# Altium project APB.PrjPCB
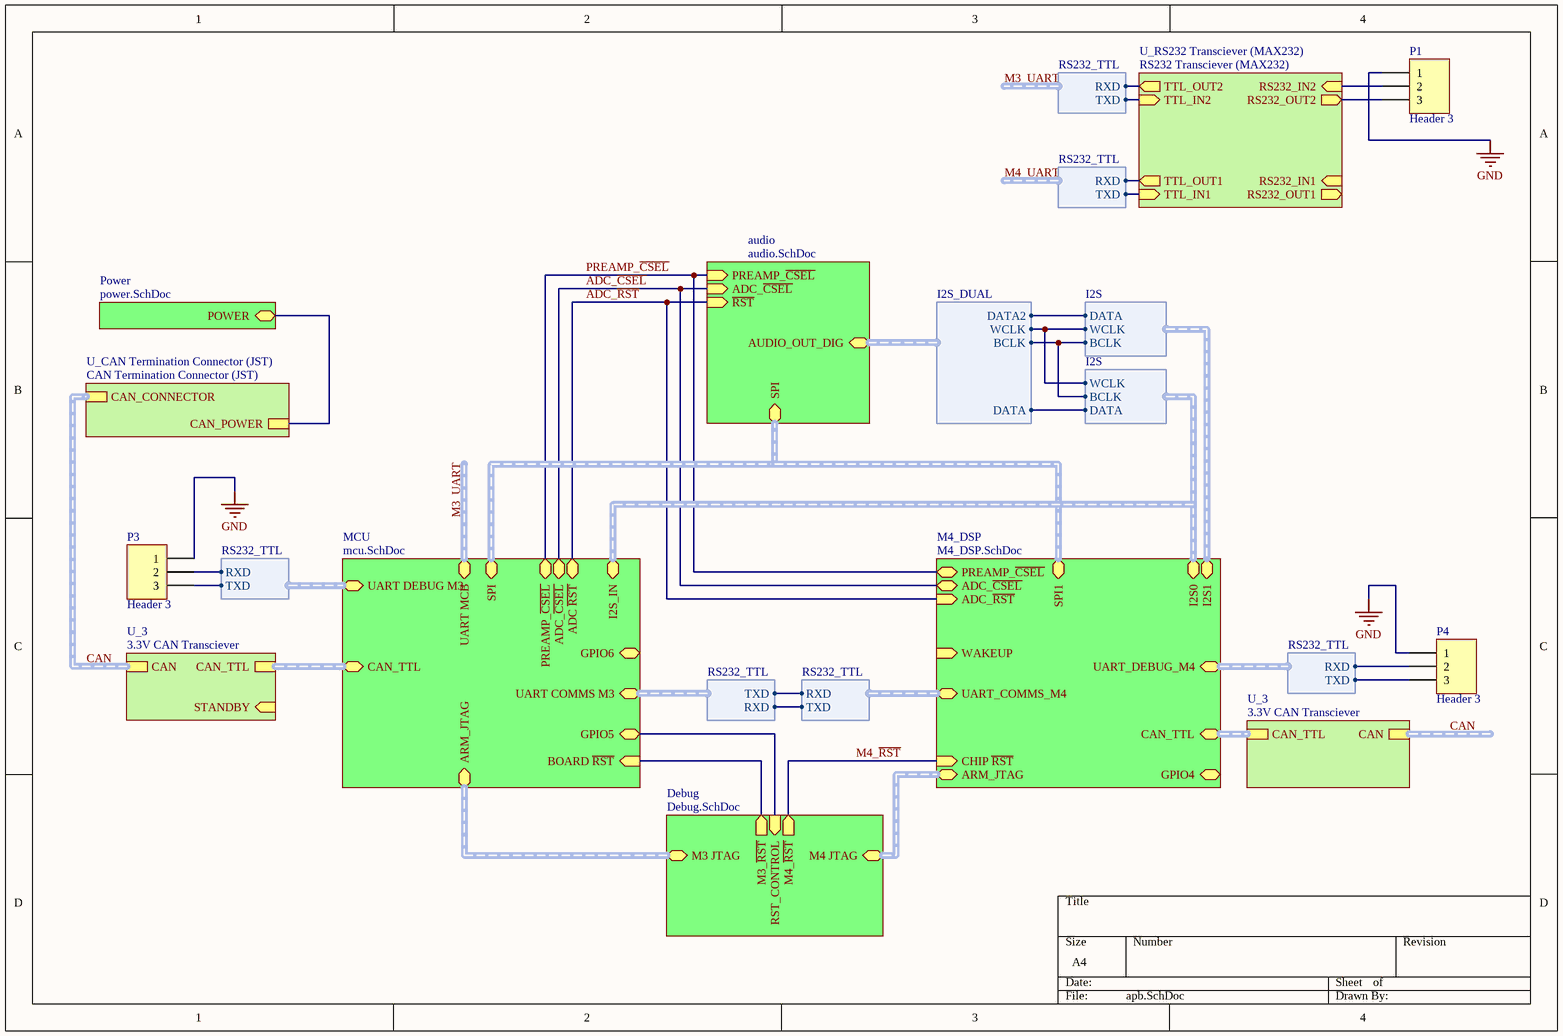
[diagram p0: apb.SchDoc]
7 sheets, 98 parts. Net scope: hierarchical (ports join the sheet entries above them; power ports are global).
Board file: APB.PcbDoc
Sheets:
  apb.SchDoc
    audio = audio.SchDoc
      Preamp = preamp.SchDoc
      Preamp = preamp.SchDoc
      Preamp = preamp.SchDoc
    Debug = Debug.SchDoc
    Power = power.SchDoc
  m4_debug.SchDoc
  SRAM.SchDoc

## Sheet apb.SchDoc
size A4

### Parts
P1  Header 3  [S03B-PASK-2]
P3  Header 3  [HDR1X3]
P4  Header 3  [HDR1X3]

### Sub-sheets
audio = audio.SchDoc: AUDIO_OUT_DIG (harness I2S_DUAL), SPI (harness SPI_NOCSEL), PREAMP_~{CSEL} (in), ADC_~{CSEL} (in), ~{RST} (in)
Debug = Debug.SchDoc: M3 JTAG (harness ARM_JTAG), M4 JTAG (harness ARM_JTAG), M4_~{RST} (out), M3_~{RST} (out), RST_CONTROL (in)
M4_DSP = M4_DSP.SchDoc (file not in this document): UART_DEBUG_M4 (harness RS232_TTL), UART_COMMS_M4 (harness RS232_TTL), I2S0 (harness I2S), CAN_TTL (harness CAN_TTL), SPI1 (harness SPI_NOCSEL), I2S1 (harness I2S), PREAMP_~{CSEL} (bidir), ADC_~{CSEL} (bidir), GPIO4 (bidir), ARM_JTAG (harness ARM_JTAG), CHIP ~{RST} (in), ADC_~{RST} (in), WAKEUP (in)
MCU = mcu.SchDoc (file not in this document): CAN_TTL (harness CAN_TTL), I2S_IN (harness I2S), UART COMMS M3 (harness RS232_TTL), UART MCB (harness RS232_TTL), UART DEBUG M3 (harness RS232_TTL), SPI (harness SPI_NOCSEL), ARM_JTAG (harness ARM_JTAG), PREAMP_~{CSEL} (bidir), ADC_~{CSEL} (bidir), ADC ~{RST} (bidir), BOARD ~{RST} (in), GPIO5 (bidir), GPIO6 (bidir)
Power = power.SchDoc: POWER
U_3 = 3.3V CAN Transciever (file not in this document): CAN_TTL (harness CAN_TTL), CAN (harness CAN)
U_3 = 3.3V CAN Transciever (file not in this document): CAN_TTL (harness CAN_TTL), CAN (harness CAN), STANDBY (in)
U_CAN Termination Connector (JST) = CAN Termination Connector (JST) (file not in this document): CAN_CONNECTOR (harness CAN), CAN_POWER
U_RS232 Transciever (MAX232) = RS232 Transciever (MAX232) (file not in this document): TTL_IN1 (in), RS232_OUT1 (out), TTL_IN2 (in), RS232_OUT2 (out), RS232_IN1 (in), RS232_IN2 (in), TTL_OUT1 (out), TTL_OUT2 (out)

### Harnesses
RS232_TTL: RXD, TXD
I2S_DUAL: BCLK, DATA, DATA2, WCLK
I2S: BCLK, DATA, WCLK

### Nets
GND: P1.1 P3.1 P4.1
ADC_~{CSEL}: sheet MCU/ADC_~{CSEL}, sheet M4_DSP/ADC_~{CSEL}, sheet audio/ADC_~{CSEL}
ADC_~{RST}: sheet MCU/ADC ~{RST}, sheet M4_DSP/ADC_~{RST}, sheet audio/~{RST}
M3_~{RST}: sheet MCU/BOARD ~{RST}, sheet Debug/M3_~{RST}
M3_UART.RXD: sheet U_RS232 Transciever (MAX232)/TTL_OUT2, sheet MCU/UART MCB.RXD
M3_UART.TXD: sheet U_RS232 Transciever (MAX232)/TTL_IN2, sheet MCU/UART MCB.TXD
M4_~{RST}: sheet M4_DSP/CHIP ~{RST}, sheet Debug/M4_~{RST}
M4_UART.RXD: sheet U_RS232 Transciever (MAX232)/TTL_OUT1, harness RS232_TTL.RXD
M4_UART.TXD: sheet U_RS232 Transciever (MAX232)/TTL_IN1, harness RS232_TTL.TXD
OUT1: sheet audio/AUDIO_OUT_DIG.BCLK, sheet M4_DSP/I2S1.BCLK, sheet MCU/I2S_IN.BCLK
OUT2: sheet audio/AUDIO_OUT_DIG.DATA, sheet MCU/I2S_IN.DATA
OUT3: sheet audio/AUDIO_OUT_DIG.DATA2, sheet M4_DSP/I2S1.DATA
OUT4: sheet audio/AUDIO_OUT_DIG.WCLK, sheet M4_DSP/I2S1.WCLK, sheet MCU/I2S_IN.WCLK
PREAMP_~{CSEL}: sheet MCU/PREAMP_~{CSEL}, sheet M4_DSP/PREAMP_~{CSEL}, sheet audio/PREAMP_~{CSEL}  [project net IN3]
NetL1_1: sheet U_CAN Termination Connector (JST)/CAN_POWER, sheet Power/POWER
NetP1_2: P1.2 ; sheet U_RS232 Transciever (MAX232)/RS232_IN2
NetP1_3: P1.3 ; sheet U_RS232 Transciever (MAX232)/RS232_OUT2
NetP3_2: P3.2 ; sheet MCU/UART DEBUG M3.RXD
NetP3_3: P3.3 ; sheet MCU/UART DEBUG M3.TXD
NetP4_2: P4.2 ; sheet M4_DSP/UART_DEBUG_M4.RXD
NetP4_3: P4.3 ; sheet M4_DSP/UART_DEBUG_M4.TXD
NetR34_1: sheet MCU/GPIO5, sheet Debug/RST_CONTROL
(unnamed): sheet MCU/UART COMMS M3.RXD, sheet M4_DSP/UART_COMMS_M4.TXD
(unnamed): sheet MCU/UART COMMS M3.TXD, sheet M4_DSP/UART_COMMS_M4.RXD

### Buses and harness runs
harness CAN = sheet U_3/CAN
harness CAN = sheet U_3/CAN = sheet U_CAN Termination Connector (JST)/CAN_CONNECTOR
harness M3_UART = sheet MCU/UART MCB
harness sheet audio/SPI = sheet M4_DSP/SPI1 = sheet MCU/SPI
harness sheet Debug/M3 JTAG = sheet MCU/ARM_JTAG
harness sheet Debug/M4 JTAG = sheet M4_DSP/ARM_JTAG
harness sheet M4_DSP/CAN_TTL = sheet U_3/CAN_TTL
harness sheet M4_DSP/I2S0 = sheet MCU/I2S_IN
harness sheet MCU/CAN_TTL = sheet U_3/CAN_TTL

### Library data of the parts
P1 P3 P4 = Header 3: Header, 3-Pin; LatestRevisionDate: 17-Jul-2002; LatestRevisionNote: Re-released for DXP Platform.; Publisher: Altium Limited

## Sheet audio.SchDoc
size A4
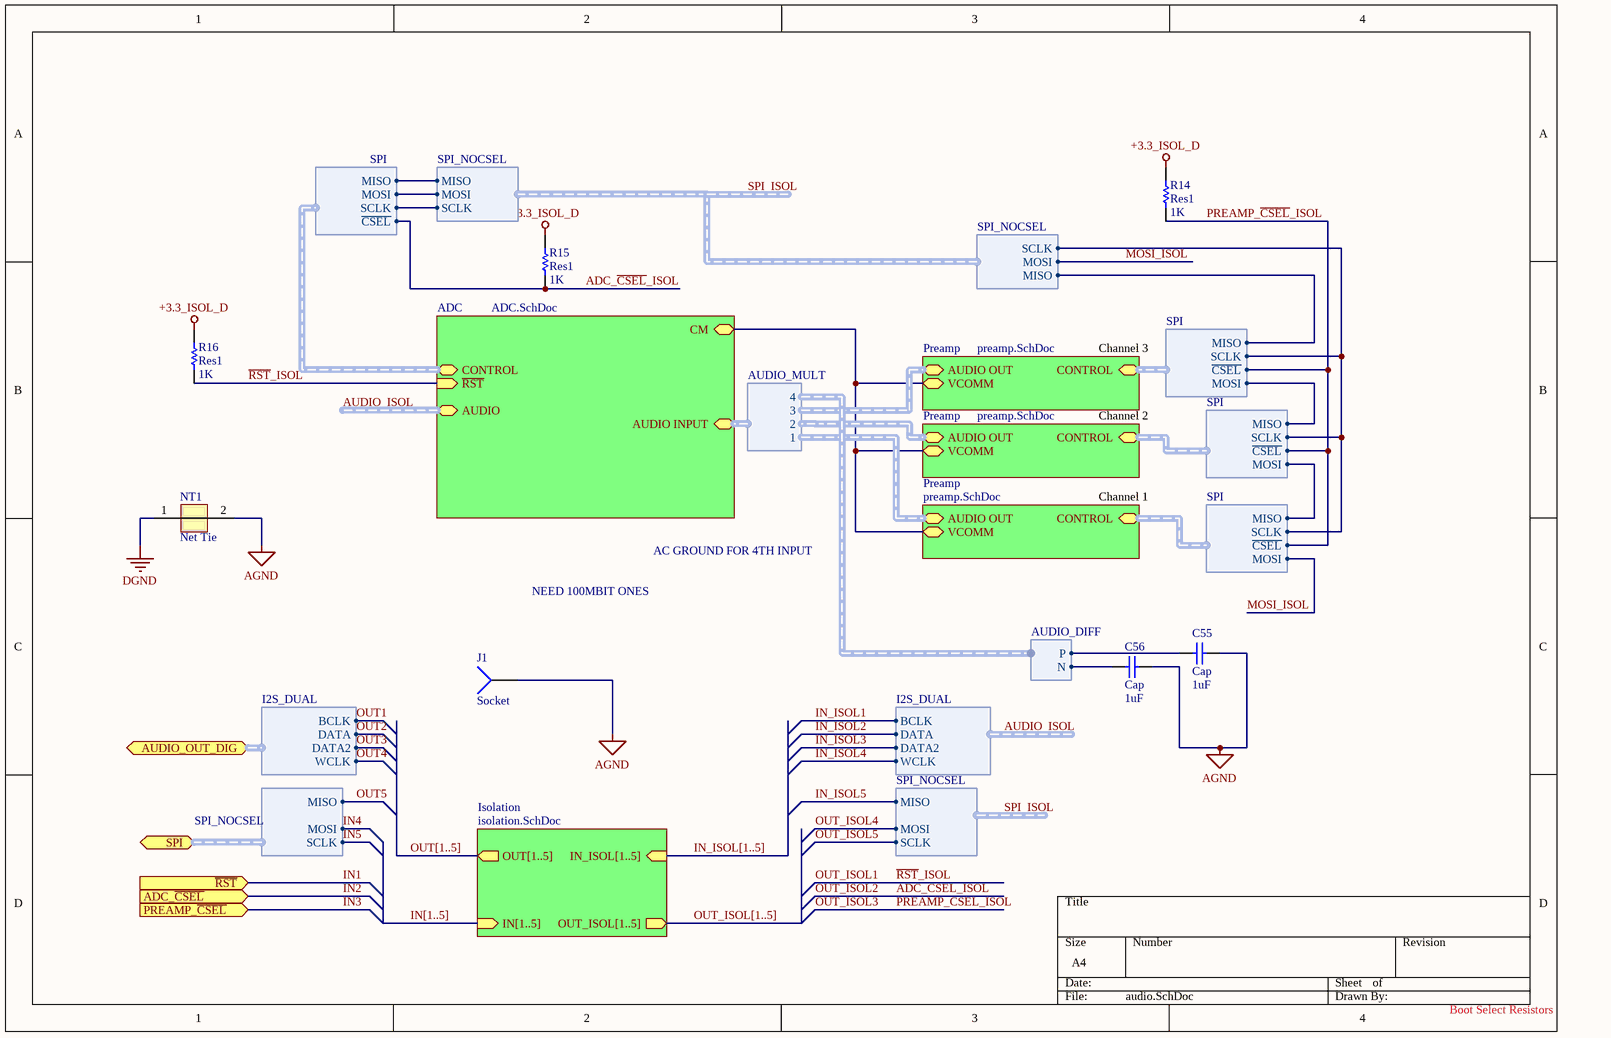
[diagram p1: audio.SchDoc]

### Parts
C55  Cap  value 1uF  [C0603]
C56  Cap  value 1uF  [C0603]
J1  Socket  [PIN1]
NT1  Net Tie  [NetTie]  (net tie, no BOM)
R14  Res1  value 1K  [R0603]
R15  Res1  value 1K  [R0603]
R16  Res1  value 1K  [R0603]

### Sub-sheets
ADC = ADC.SchDoc (file not in this document): CONTROL (harness SPI), ~{RST} (in), AUDIO (harness I2S_DUAL), AUDIO INPUT (harness AUDIO_MULT), CM
Isolation = isolation.SchDoc (file not in this document): OUT_ISOL[1..5] (out), OUT[1..5] (out), IN[1..5] (in), IN_ISOL[1..5] (in)
Preamp = preamp.SchDoc: CONTROL (harness SPI), AUDIO OUT (harness AUDIO_DIFF), VCOMM
Preamp = preamp.SchDoc: CONTROL (harness SPI), AUDIO OUT (harness AUDIO_DIFF), VCOMM
Preamp = preamp.SchDoc: CONTROL (harness SPI), AUDIO OUT (harness AUDIO_DIFF), VCOMM

### Ports
ADC_~{CSEL} (in), AUDIO_OUT_DIG (harness I2S_DUAL), PREAMP_~{CSEL} (in), SPI (harness SPI_NOCSEL), ~{RST} (in)

### Harnesses
AUDIO_MULT: 1, 2, 3, 4
SPI: ~{CSEL}, MISO, MOSI, SCLK
SPI_NOCSEL: MISO, MOSI, SCLK
I2S_DUAL: BCLK, DATA, DATA2, WCLK
AUDIO_DIFF: N, P

### Nets
+3.3_ISOL_D: R14.2 R15.2 R16.2
AGND: C55.1 C56.1 J1.1 NT1.2
DGND: NT1.1
ADC_~{CSEL}_ISOL: R15.1 ; sheet ADC/CONTROL.~{CSEL}  [also labelled OUT_ISOL2]
IN1: port ~{RST}  [project net ADC_~{RST}]
IN2: port ADC_~{CSEL}  [project net ADC_~{CSEL}]
IN3: port PREAMP_~{CSEL}
IN4: port SPI.MOSI
IN5: port SPI.SCLK
IN_ISOL1: sheet ADC/AUDIO.BCLK  [project net AUDIO_ISOL.BCLK]
IN_ISOL2: sheet ADC/AUDIO.DATA  [project net AUDIO_ISOL.DATA]
IN_ISOL3: sheet ADC/AUDIO.DATA2  [project net AUDIO_ISOL.DATA2]
IN_ISOL4: sheet ADC/AUDIO.WCLK  [project net AUDIO_ISOL.WCLK]
IN_ISOL5: sheet Preamp/CONTROL.MISO, sheet ADC/CONTROL.MISO, harness SPI_NOCSEL.MISO
MOSI_ISOL: sheet Preamp/CONTROL.MOSI, sheet ADC/CONTROL.MOSI, harness SPI_NOCSEL.MOSI  [also labelled OUT_ISOL4]
OUT1: port AUDIO_OUT_DIG.BCLK
OUT2: port AUDIO_OUT_DIG.DATA
OUT3: port AUDIO_OUT_DIG.DATA2
OUT4: port AUDIO_OUT_DIG.WCLK
OUT5: port SPI.MISO
OUT_ISOL1: R16.1 ; sheet ADC/~{RST}  [also labelled ~{RST}_ISOL]
OUT_ISOL3: R14.1 ; sheet Preamp/CONTROL.~{CSEL}  [also labelled PREAMP_~{CSEL}_ISOL]
OUT_ISOL5: sheet Preamp/CONTROL.SCLK, sheet ADC/CONTROL.SCLK, harness SPI_NOCSEL.SCLK
NetC55_2: C55.2 ; harness AUDIO_DIFF.P
NetC56_2: C56.2 ; harness AUDIO_DIFF.N
NetC63_audio_Preamp#1_2: sheet Preamp/VCOMM, sheet ADC/CM, sheet Preamp/VCOMM, sheet Preamp/VCOMM
NetU9_audio_Preamp#1_8: sheet Preamp/CONTROL.MOSI, sheet Preamp/CONTROL.MISO
NetU9_audio_Preamp#2_8: sheet Preamp/CONTROL.MOSI, sheet Preamp/CONTROL.MISO

### Buses and harness runs
bus IN[1..5] = sheet Isolation/IN[1..5]
bus IN_ISOL[1..5] = sheet Isolation/IN_ISOL[1..5]
bus OUT[1..5] = sheet Isolation/OUT[1..5]
bus OUT_ISOL[1..5] = sheet Isolation/OUT_ISOL[1..5]
harness AUDIO_ISOL = sheet ADC/AUDIO

### Notes on the sheet
- Channel 3
- Channel 2
- Channel 1
- AC GROUND FOR 4TH INPUT
- NEED 100MBIT ONES
- Boot Select Resistors

### Library data of the parts
C55 C56 = Cap: Capacitor; Published: 8-Jun-2000; LatestRevisionDate: 17-Jul-2002; LatestRevisionNote: Re-released for DXP Platform.; PackageReference: RAD-0.3; Publisher: Altium Limited
NT1 = NetTie
R14-R16 = Res1: Resistor; Published: 8-Jun-2000; LatestRevisionDate: 17-Jul-2002; LatestRevisionNote: Re-released for DXP Platform.; PackageReference: AXIAL-0.3; Publisher: Altium Limited
J1 = Socket: LatestRevisionDate: 17-Jul-2002; LatestRevisionNote: Re-released for DXP Platform.; Publisher: Altium Limited

## Sheet preamp.SchDoc
size A4
Used 3 times, as channels audio/Preamp, audio/Preamp, audio/Preamp. Parts and nets are listed once, with the designators drawn on the sheet.
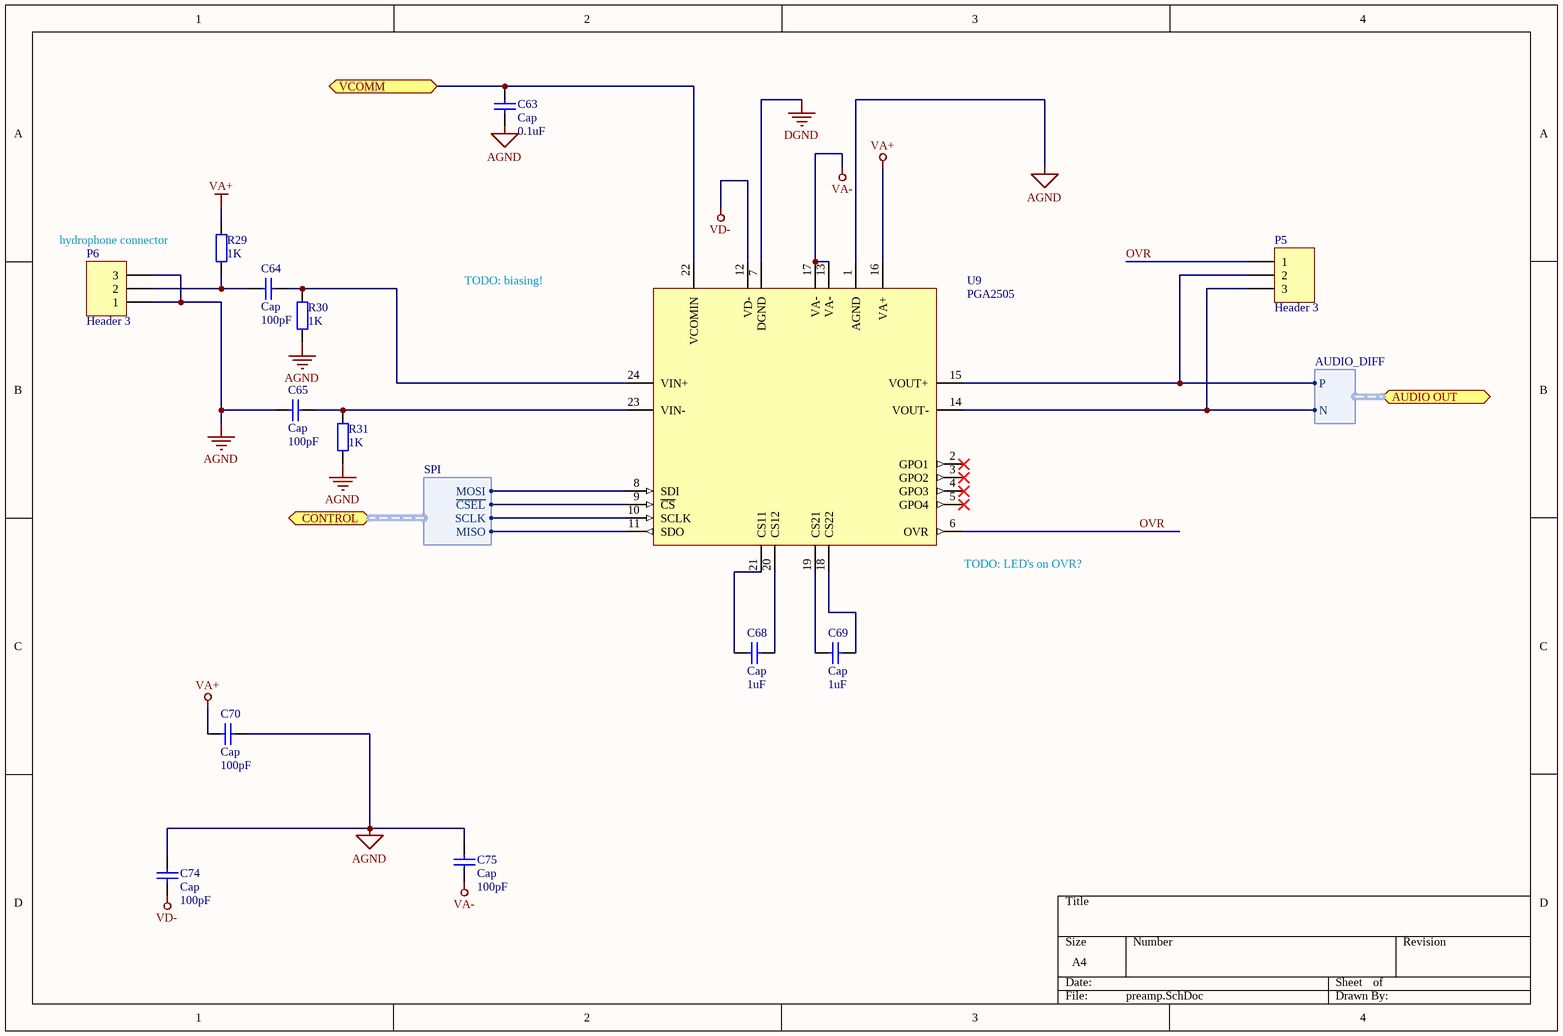
[diagram p2: preamp.SchDoc]

### Parts
C63  Cap  value 0.1uF  [C0603]
C64  Cap  value 100pF  [C0603]
C65  Cap  value 100pF  [C0603]
C68  Cap  value 1uF  [C0603]
C69  Cap  value 1uF  [C0603]
C70  Cap  value 100pF  [C0603]
C74  Cap  value 100pF  [C0603]
C75  Cap  value 100pF  [C0603]
P5  Header 3  [HDR1X3]
P6  Header 3  [S03B-PASK-2]
R29  value 1K  [R0603]  (hidden comment: Res2)
R30  value 1K  [R0603]  (hidden comment: Res2)
R31  value 1K  [R0603]  (hidden comment: Res2)
U9  PGA2505  [SOP65P780X200-24N]

### Ports
AUDIO OUT (harness AUDIO_DIFF), CONTROL (harness SPI), VCOMM

### Harnesses
SPI: ~{CSEL}, MISO, MOSI, SCLK
AUDIO_DIFF: N, P

### Nets
AGND: C63.1 C65.2 C70.2 C74.2 C75.2 P6.1 P6.3 R30.1 R31.1 U9.1(AGND)
DGND: U9.7(DGND)
VA+: C70.1 R29.2 U9.16(VA+)
VA-: C75.1 U9.13(VA-) U9.17(VA-)
VD-: C74.1 U9.12(VD-)
OVR: P5.1 U9.6(OVR)
VCOMM: C63.2 U9.22(VCOMIN) ; port VCOMM
NetC64_1: C64.1 R30.2 U9.24(VIN+)
NetC64_2: C64.2 P6.2 R29.1
NetC65_1: C65.1 R31.2 U9.23(VIN-)
NetC68_1: C68.1 U9.21(CS11)
NetC68_2: C68.2 U9.20(CS12)
NetC69_1: C69.1 U9.19(CS21)
NetC69_2: C69.2 U9.18(CS22)
NetP5_2: P5.2 U9.15(VOUT+) ; port AUDIO OUT.P
NetP5_3: P5.3 U9.14(VOUT-) ; port AUDIO OUT.N
NetU9_8: U9.8(SDI) ; port CONTROL.MOSI
NetU9_9: U9.9(~{CS}) ; port CONTROL.~{CSEL}
NetU9_10: U9.10(SCLK) ; port CONTROL.SCLK
NetU9_11: U9.11(SDO) ; port CONTROL.MISO

Not connected (* = marked no-connect by the designer): U9 2(GPO1)* 3(GPO2)* 4(GPO3)* 5(GPO4)*

### Channels
audio/Preamp: designators end in _audio_Preamp#1; ports VCOMM=NetC63_audio_Preamp#1_2
audio/Preamp: designators end in _audio_Preamp#2; ports VCOMM=NetC63_audio_Preamp#1_2
audio/Preamp: designators end in _audio_Preamp#3; ports VCOMM=NetC63_audio_Preamp#1_2

### Notes on the sheet
- hydrophone connector
- TODO: biasing!
- (near U9) TODO: LED's on OVR?

### Library data of the parts
C63-C65 C68-C70 C74 C75 = Cap: Capacitor; Published: 8-Jun-2000; LatestRevisionDate: 17-Jul-2002; LatestRevisionNote: Re-released for DXP Platform.; PackageReference: RAD-0.3; Publisher: Altium Limited
P5 P6 = Header 3: Header, 3-Pin; LatestRevisionDate: 17-Jul-2002; LatestRevisionNote: Re-released for DXP Platform.; Publisher: Altium Limited
R29-R31 = Res2: Resistor; Published: 8-Jun-2000; LatestRevisionDate: 17-Jul-2002; LatestRevisionNote: Re-released for DXP Platform.; PackageReference: AXIAL-0.4; Publisher: Altium Limited
U9 = PGA2505: IC, MICROPHONE AMP, 24TSSOP; farnell: 1735567

## Sheet Debug.SchDoc
size A4
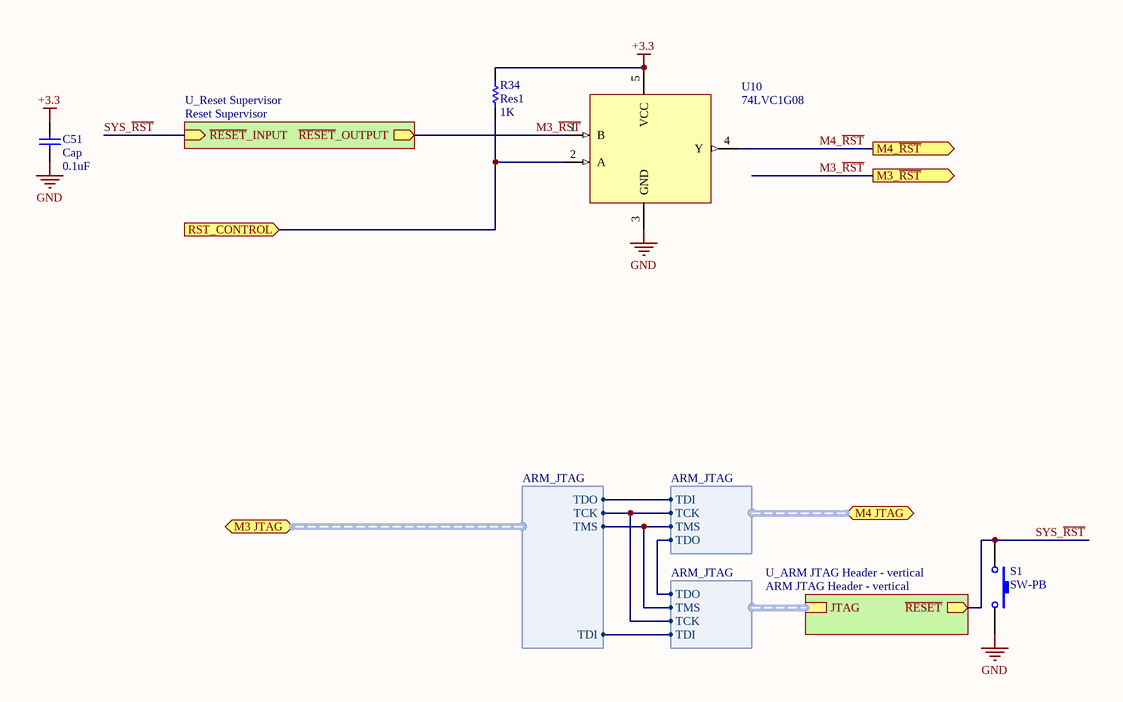
[diagram p3: Debug.SchDoc]

### Parts
C51  Cap  value 0.1uF  [C0603]
R34  Res1  value 1K  [R0603]
S1  SW-PB  [DTSM-32S-B]
U10  74LVC1G08  [SOT23127P600-8N]

### Sub-sheets
U_ARM JTAG Header - vertical = ARM JTAG Header - vertical (file not in this document): JTAG (harness ARM_JTAG), ~{RESET} (out)
U_Reset Supervisor = Reset Supervisor (file not in this document): ~{RESET}_OUTPUT (out), ~{RESET}_INPUT (in)

### Ports
M3 JTAG (harness ARM_JTAG), M3_~{RST} (out), M4 JTAG (harness ARM_JTAG), M4_~{RST} (out), RST_CONTROL (in)

### Harnesses
ARM_JTAG: TCK, TDI, TDO, TMS

### Nets
+3.3: C51.1 R34.2 U10.5(VCC)
GND: C51.2 S1.2 U10.3(GND)
M3_~{RST}: U10.1(B) ; port M3_~{RST}, sheet U_Reset Supervisor/~{RESET}_OUTPUT
M4_~{RST}: U10.4(Y) ; port M4_~{RST}
SYS_~{RST}: S1.1 ; sheet U_Reset Supervisor/~{RESET}_INPUT, sheet U_ARM JTAG Header - vertical/~{RESET}
NetR34_1: R34.1 U10.2(A) ; port RST_CONTROL
(unnamed): port M3 JTAG.TCK, port M4 JTAG.TCK, sheet U_ARM JTAG Header - vertical/JTAG.TCK
(unnamed): port M3 JTAG.TDI, sheet U_ARM JTAG Header - vertical/JTAG.TDI
(unnamed): port M3 JTAG.TDO, port M4 JTAG.TDI
(unnamed): port M3 JTAG.TMS, port M4 JTAG.TMS, sheet U_ARM JTAG Header - vertical/JTAG.TMS
(unnamed): port M4 JTAG.TDO, sheet U_ARM JTAG Header - vertical/JTAG.TDO

### Library data of the parts
C51 = Cap: Capacitor; Published: 8-Jun-2000; LatestRevisionDate: 17-Jul-2002; LatestRevisionNote: Re-released for DXP Platform.; PackageReference: RAD-0.3; Publisher: Altium Limited
R34 = Res1: Resistor; Published: 8-Jun-2000; LatestRevisionDate: 17-Jul-2002; LatestRevisionNote: Re-released for DXP Platform.; PackageReference: AXIAL-0.3; Publisher: Altium Limited
S1 = SW-PB: Switch; Published: 24-Mar-1999; LatestRevisionDate: 17-Jul-2002; LatestRevisionNote: Re-released for DXP Platform.; PackageReference: SPST-2; Publisher: Altium Limited
U10 = 74LVC1G08: farnell: 1631684

## Sheet power.SchDoc
size A4
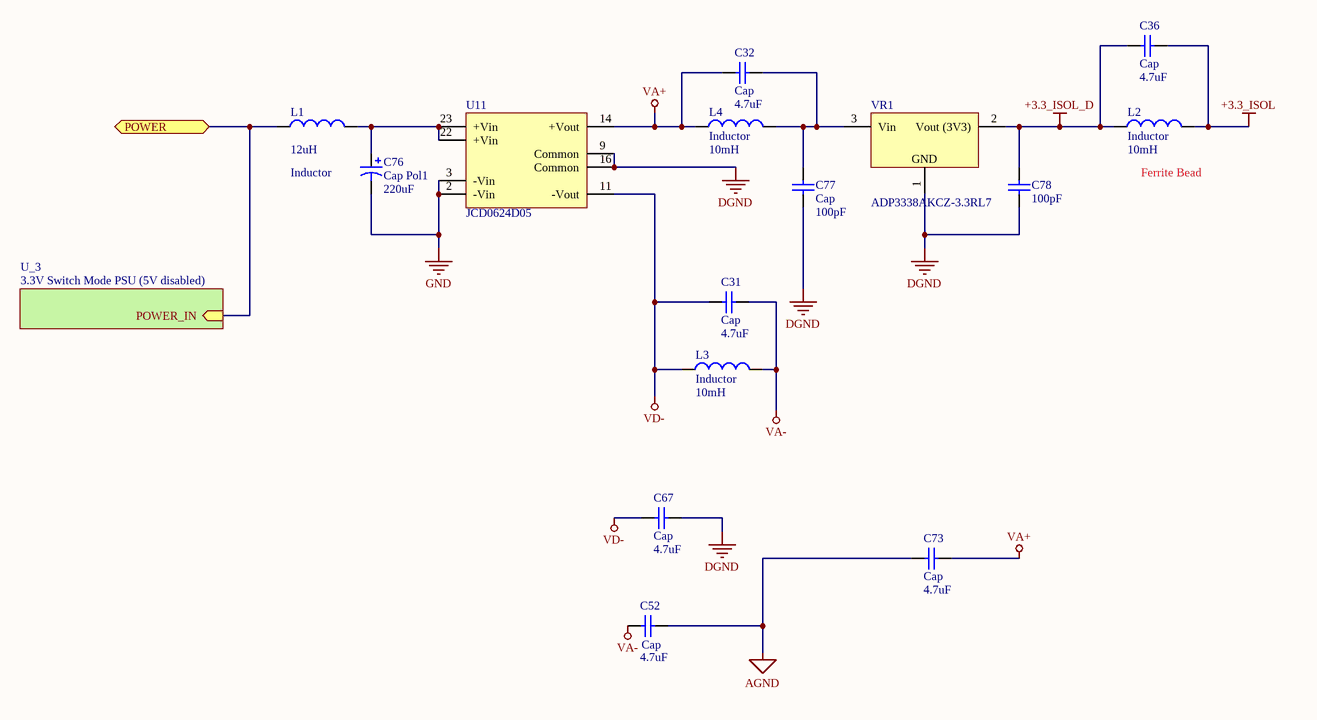
[diagram p4: power.SchDoc]

### Parts
C31  Cap  value 4.7uF  [C0603]
C32  Cap  value 4.7uF  [C0603]
C36  Cap  value 4.7uF  [C0603]
C52  Cap  value 4.7uF  [C0603]
C67  Cap  value 4.7uF  [C0603]
C73  Cap  value 4.7uF  [C0603]
C76  Cap Pol1  value 220uF  [Capacitor]
C77  Cap  value 100pF  [C0805]
C78  value 100pF  [C0805]  (hidden comment: Cap)
L1  Inductor  value 12uH  [SDR0604-150YL]
L2  Inductor  value 10mH  [C0805]
L3  Inductor  value 10mH  [C0805]
L4  Inductor  value 10mH  [C0805]
U11  JCD0624D05  [DIP24]
VR1  ADP3338AKCZ-3.3RL7  [ADP3338AKCZ-3.3RL7]

### Sub-sheets
U_3 = 3.3V Switch Mode PSU (5V disabled) (file not in this document): POWER_IN (in)

### Ports
POWER

### Nets
+3.3_ISOL: C36.2 L2.2
+3.3_ISOL_D: C36.1 C78.1 L2.1 VR1.2(Vout_(3V3))
AGND: C52.2 C73.1
DGND: C67.2 C77.1 C78.2 U11.9(Common) U11.16(Common) VR1.1(GND)
GND: C76.2 U11.2(-Vin) U11.3(-Vin)
VA+: C32.1 C73.2 L4.1 U11.14(+Vout)
VA-: C31.2 C52.1 L3.2
VD-: C31.1 C67.1 L3.1 U11.11(-Vout)
NetC32_2: C32.2 C77.2 L4.2 VR1.3(Vin)
NetC76_1: C76.1 L1.2 U11.22(+Vin) U11.23(+Vin)
NetL1_1: L1.1 ; port POWER, sheet U_3/POWER_IN

### Notes on the sheet
- (near L2) Ferrite Bead

### Library data of the parts
C31 C32 C36 C52 C67 C73 C77 C78 = Cap: Capacitor; Published: 8-Jun-2000; LatestRevisionDate: 17-Jul-2002; LatestRevisionNote: Re-released for DXP Platform.; PackageReference: RAD-0.3; Publisher: Altium Limited
C76 = Cap Pol1: Polarized Capacitor (Radial); Published: 8-Jun-2000; LatestRevisionDate: 17-Jul-2002; LatestRevisionNote: Re-released for DXP Platform.; PackageReference: RB7.6-15; Publisher: Altium Limited; farnell: 1831303
L1-L4 = Inductor: Code_IEC: 1005; Published: 8-Jun-2000; LatestRevisionDate: 29-May-2009; LatestRevisionNote: IPC-7351 Footprint Added.; PackageReference: 0402-A; Publisher: Altium Limited; PackageDescription: Chip Inductor; Code_JEITA: 0402
  L1: farnell: 744773112
U11 = JCD0624D05: DC/DC CONVERTER, 6W, +/-5V, DIP-24; farnell: 2065315
VR1 = ADP3338AKCZ-3.3RL7: 3.3V LDO Regulator; farnell: 1651283

## Sheet m4_debug.SchDoc
size A4
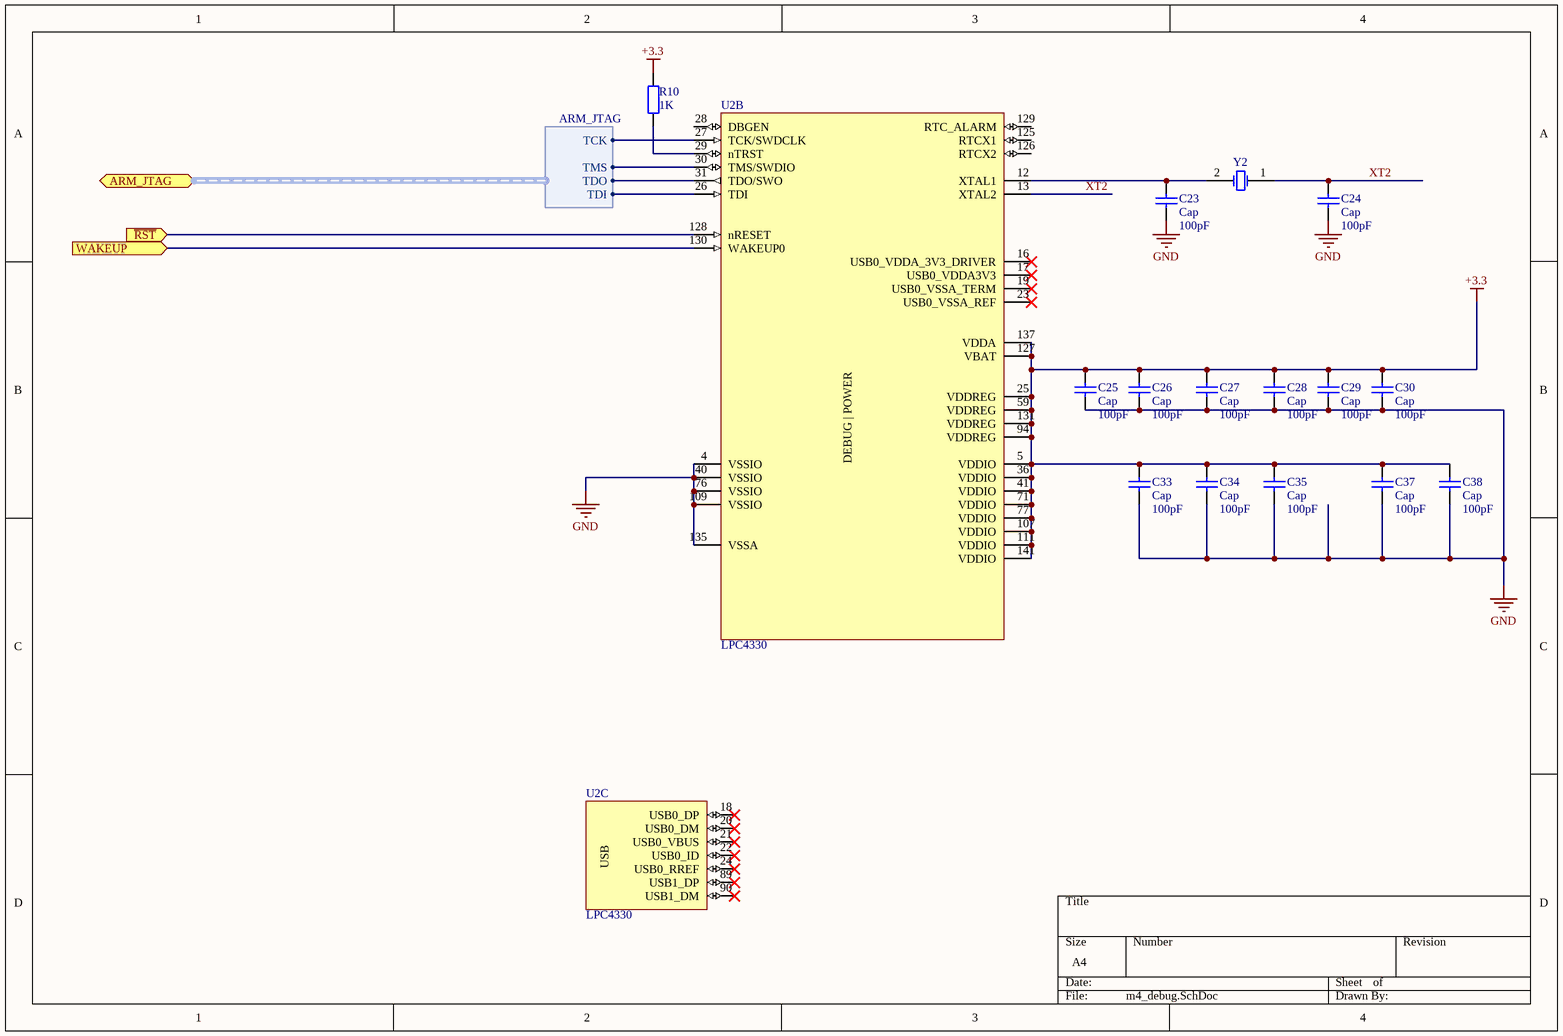
[diagram p5: m4_debug.SchDoc]

### Parts
C23  Cap  value 100pF  [C0603]
C24  Cap  value 100pF  [C0603]
C25  Cap  value 100pF  [C0603]
C26  Cap  value 100pF  [C0603]
C27  Cap  value 100pF  [C0603]
C28  Cap  value 100pF  [C0603]
C29  Cap  value 100pF  [C0603]
C30  Cap  value 100pF  [C0603]
C33  Cap  value 100pF  [C0603]
C34  Cap  value 100pF  [C0603]
C35  Cap  value 100pF  [C0603]
C37  Cap  value 100pF  [C0603]
C38  Cap  value 100pF  [C0603]
R10  value 1K  [R0603]  (hidden comment: Res2)
U2  LPC4330  [TSQFP50P2200X2200X160-144N]  (parts B,C of 5)
Y2  XTAL  [C3E-24.000-12-3030-X]  (value not drawn)

### Ports
ARM_JTAG (harness ARM_JTAG), WAKEUP (in), ~{RST} (in)

### Harnesses
ARM_JTAG: TCK, TDI, TDO, TMS

### Nets
+3.3: C25.1 C26.1 C27.1 C28.1 C29.1 C30.1 C33.1 C34.1 C35.1 C37.1 C38.1 R10.2 U2.5(VDDIO) U2.25(VDDREG) U2.36(VDDIO) U2.41(VDDIO) U2.59(VDDREG) U2.71(VDDIO) U2.77(VDDIO) U2.94(VDDREG) U2.107(VDDIO) U2.111(VDDIO) U2.127(VBAT) U2.131(VDDREG) U2.137(VDDA) U2.141(VDDIO)
GND: C23.1 C24.1 C25.2 C26.2 C27.2 C28.2 C29.2 C30.2 C33.2 C34.2 C35.2 C37.2 C38.2 U2.4(VSSIO) U2.40(VSSIO) U2.76(VSSIO) U2.109(VSSIO) U2.135(VSSA)
XT2: C24.2 U2.13(XTAL2) Y2.1(OSC1)
NetC23_2: C23.2 U2.12(XTAL1) Y2.2(OSC2)
NetR10_1: R10.1 U2.29(nTRST)
NetU2_26: U2.26(TDI) ; port ARM_JTAG.TDI
NetU2_27: U2.27(TCK/SWDCLK) ; port ARM_JTAG.TCK
NetU2_30: U2.30(TMS/SWDIO) ; port ARM_JTAG.TMS
NetU2_31: U2.31(TDO/SWO) ; port ARM_JTAG.TDO
NetU2_128: U2.128(nRESET) ; port ~{RST}
NetU2_130: U2.130(WAKEUP0) ; port WAKEUP

Not connected (* = marked no-connect by the designer): U2 16(USB0_VDDA_3V3_DRIVER)* 17(USB0_VDDA3V3)* 18(USB0_DP)* 19(USB0_VSSA_TERM)* 20(USB0_DM)* 21(USB0_VBUS)* 22(USB0_ID)* 23(USB0_VSSA_REF)* 24(USB0_RREF)* 28(DBGEN) 89(USB1_DP)* 90(USB1_DM)* 125(RTCX1) 126(RTCX2) 129(RTC_ALARM)

### Notes on the sheet
- (in symbol LPC4330, part B) DEBUG | POWER
- (in symbol LPC4330, part C) USB

### Library data of the parts
C23-C30 C33-C35 C37 C38 = Cap: Capacitor; Published: 8-Jun-2000; LatestRevisionDate: 17-Jul-2002; LatestRevisionNote: Re-released for DXP Platform.; PackageReference: RAD-0.3; Publisher: Altium Limited
R10 = Res2: Resistor; Published: 8-Jun-2000; LatestRevisionDate: 17-Jul-2002; LatestRevisionNote: Re-released for DXP Platform.; PackageReference: AXIAL-0.4; Publisher: Altium Limited
U2 = LPC4330: MCU, 32BIT, ARM CORTEX M4&M0, 144LQFP; farnell: 2094316
Y2 = XTAL: Crystal Oscillator; Published: 8-Jun-2000; LatestRevisionDate: 17-Jul-2002; LatestRevisionNote: Re-released for DXP Platform.; PackageReference: R38; Publisher: Altium Limited

## Sheet SRAM.SchDoc
size A4
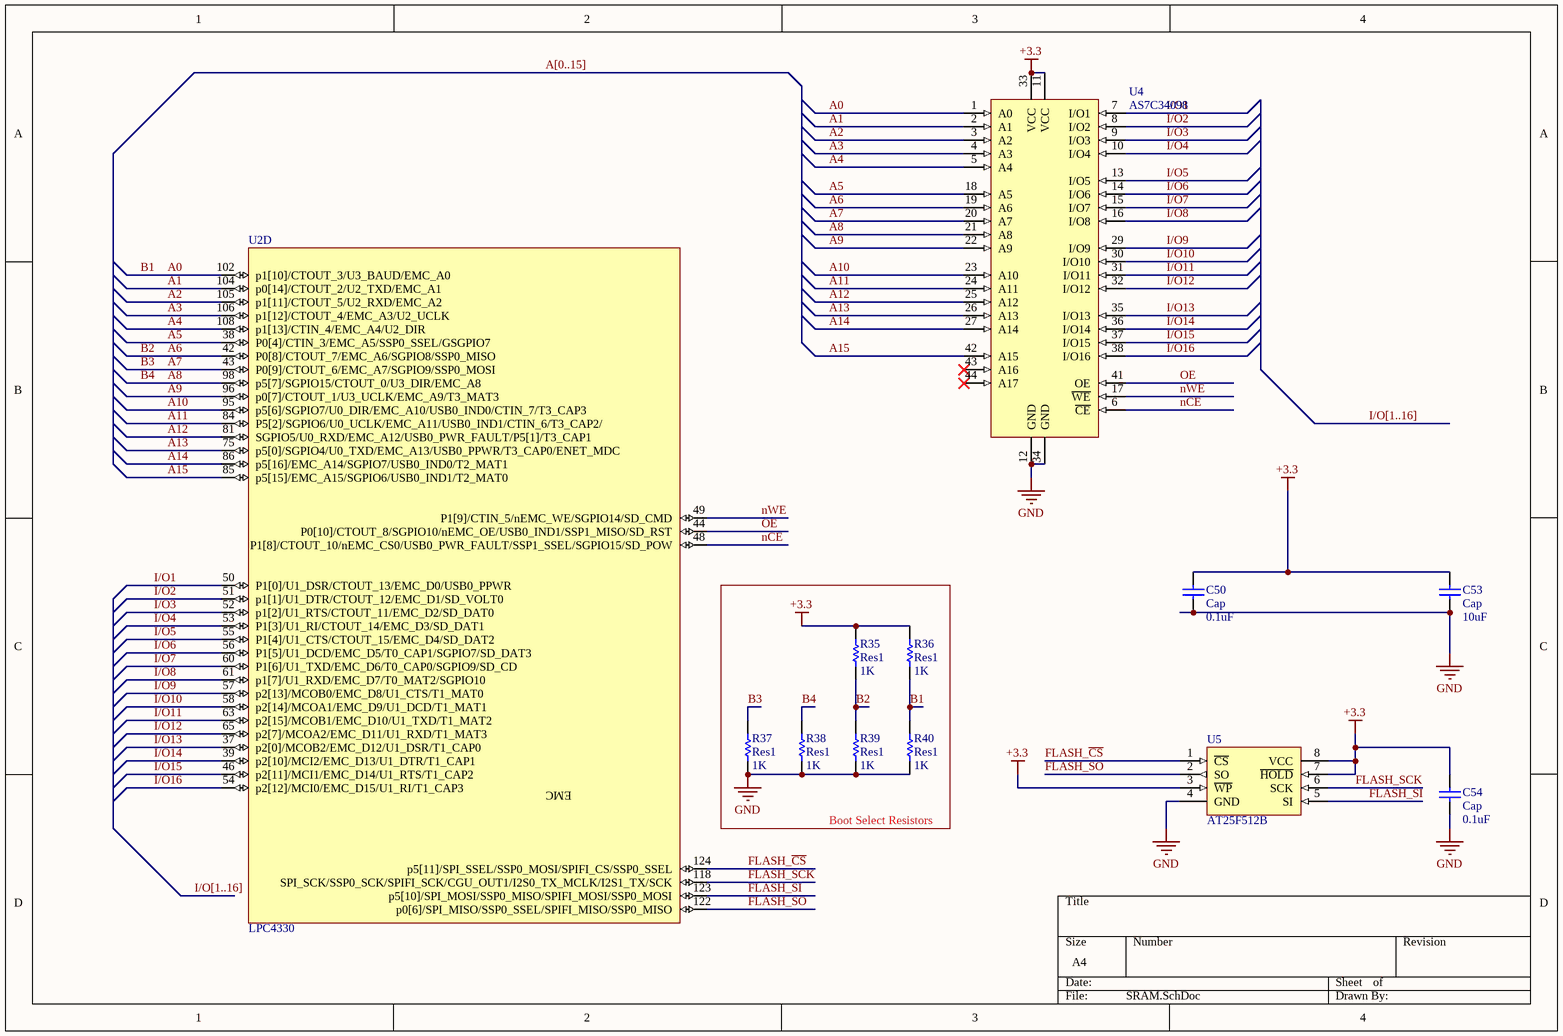
[diagram p6: SRAM.SchDoc]

### Parts
C50  Cap  value 0.1uF  [C0603]
C53  Cap  value 10uF  [C0603]
C54  Cap  value 0.1uF  [C0603]
R35  Res1  value 1K  [R0603]
R36  Res1  value 1K  [R0603]
R37  Res1  value 1K  [R0603]
R38  Res1  value 1K  [R0603]
R39  Res1  value 1K  [R0603]
R40  Res1  value 1K  [R0603]
U2  LPC4330  [TSQFP50P2200X2200X160-144N]  (part D of 5)
U4  AS7C34098  [TSOP80P1180X120-44N]
U5  AT25F512B  [SOIC127P600-8N]

### Blocks framed on the sheet
Boot Select Resistors: R35-R40

### Nets
+3.3: C50.2 C53.2 C54.2 R35.2 R36.2 U4.11(VCC) U4.33(VCC) U5.3(~{WP}) U5.7(~{HOLD}) U5.8(VCC)
GND: C50.1 C53.1 C54.1 R37.1 R38.1 R39.1 R40.1 U4.12(GND) U4.34(GND) U5.4(GND)
A0: R36.1 R40.2 U2.102(p1[10]/CTOUT_3/U3_BAUD/EMC_A0) U4.1(A0)  [also labelled B1]
A1: U2.104(p0[14]/CTOUT_2/U2_TXD/EMC_A1) U4.2(A1)
A2: U2.105(p1[11]/CTOUT_5/U2_RXD/EMC_A2) U4.3(A2)
A3: U2.106(p1[12]/CTOUT_4/EMC_A3/U2_UCLK) U4.4(A3)
A4: U2.108(p1[13]/CTIN_4/EMC_A4/U2_DIR) U4.5(A4)
A5: U2.38(P0[4]/CTIN_3/EMC_A5/SSP0_SSEL/GSGPIO7) U4.18(A5)
A6: R35.1 R39.2 U2.42(P0[8]/CTOUT_7/EMC_A6/SGPIO8/SSP0_MISO) U4.19(A6)  [also labelled B2]
A7: R37.2 U2.43(P0[9]/CTOUT_6/EMC_A7/SGPIO9/SSP0_MOSI) U4.20(A7)  [also labelled B3]
A8: R38.2 U2.98(p5[7]/SGPIO15/CTOUT_0/U3_DIR/EMC_A8) U4.21(A8)  [also labelled B4]
A9: U2.96(p0[7]/CTOUT_1/U3_UCLK/EMC_A9/T3_MAT3) U4.22(A9)
A10: U2.95(p5[6]/SGPIO7/U0_DIR/EMC_A10/USB0_IND0/CTIN_7/T3_CAP3) U4.23(A10)
A11: U2.84(P5[2]/SGPIO6/U0_UCLK/EMC_A11/USB0_IND1/CTIN_6/T3_CAP2/) U4.24(A11)
A12: U2.81(SGPIO5/U0_RXD/EMC_A12/USB0_PWR_FAULT/P5[1]/T3_CAP1) U4.25(A12)
A13: U2.75(p5[0]/SGPIO4/U0_TXD/EMC_A13/USB0_PPWR/T3_CAP0/ENET_MDC) U4.26(A13)
A14: U2.86(p5[16]/EMC_A14/SGPIO7/USB0_IND0/T2_MAT1) U4.27(A14)
A15: U2.85(p5[15]/EMC_A15/SGPIO6/USB0_IND1/T2_MAT0) U4.42(A15)
FLASH_~{CS}: U2.124(p5[11]/SPI_SSEL/SSP0_MOSI/SPIFI_CS/SSP0_SSEL) U5.1(~{CS})
FLASH_SCK: U2.118(SPI_SCK/SSP0_SCK/SPIFI_SCK/CGU_OUT1/I2S0_TX_MCLK/I2S1_TX/SCK) U5.6(SCK)
FLASH_SI: U2.123(p5[10]/SPI_MOSI/SSP0_MISO/SPIFI_MOSI/SSP0_MOSI) U5.5(SI)
FLASH_SO: U2.122(p0[6]/SPI_MISO/SSP0_SSEL/SPIFI_MISO/SSP0_MISO) U5.2(SO)
I/O1: U2.50(P1[0]/U1_DSR/CTOUT_13/EMC_D0/USB0_PPWR) U4.7(I/O1)
I/O2: U2.51(p1[1]/U1_DTR/CTOUT_12/EMC_D1/SD_VOLT0) U4.8(I/O2)
I/O3: U2.52(p1[2]/U1_RTS/CTOUT_11/EMC_D2/SD_DAT0) U4.9(I/O3)
I/O4: U2.53(P1[3]/U1_RI/CTOUT_14/EMC_D3/SD_DAT1) U4.10(I/O4)
I/O5: U2.55(P1[4]/U1_CTS/CTOUT_15/EMC_D4/SD_DAT2) U4.13(I/O5)
I/O6: U2.56(P1[5]/U1_DCD/EMC_D5/T0_CAP1/SGPIO7/SD_DAT3) U4.14(I/O6)
I/O7: U2.60(P1[6]/U1_TXD/EMC_D6/T0_CAP0/SGPIO9/SD_CD) U4.15(I/O7)
I/O8: U2.61(p1[7]/U1_RXD/EMC_D7/T0_MAT2/SGPIO10) U4.16(I/O8)
I/O9: U2.57(p2[13]/MCOB0/EMC_D8/U1_CTS/T1_MAT0) U4.29(I/O9)
I/O10: U2.58(p2[14]/MCOA1/EMC_D9/U1_DCD/T1_MAT1) U4.30(I/O10)
I/O11: U2.63(p2[15]/MCOB1/EMC_D10/U1_TXD/T1_MAT2) U4.31(I/O11)
I/O12: U2.65(p2[7]/MCOA2/EMC_D11/U1_RXD/T1_MAT3) U4.32(I/O12)
I/O13: U2.37(p2[0]/MCOB2/EMC_D12/U1_DSR/T1_CAP0) U4.35(I/O13)
I/O14: U2.39(p2[10]/MCI2/EMC_D13/U1_DTR/T1_CAP1) U4.36(I/O14)
I/O15: U2.46(p2[11]/MCI1/EMC_D14/U1_RTS/T1_CAP2) U4.37(I/O15)
I/O16: U2.54(p2[12]/MCI0/EMC_D15/U1_RI/T1_CAP3) U4.38(I/O16)
nCE: U2.48(P1[8]/CTOUT_10/nEMC_CS0/USB0_PWR_FAULT/SSP1_SSEL/SGPIO15/SD_POW) U4.6(~{CE})
nWE: U2.49(P1[9]/CTIN_5/nEMC_WE/SGPIO14/SD_CMD) U4.17(~{WE})
OE: U2.44(P0[10]/CTOUT_8/SGPIO10/nEMC_OE/USB0_IND1/SSP1_MISO/SD_RST) U4.41(OE)

Not connected (* = marked no-connect by the designer): U4 43(A16)* 44(A17)*

### Buses and harness runs
bus A[0..15]
bus I/O[1..16]

### Notes on the sheet
- (in symbol LPC4330, part D) EMC

### Library data of the parts
C50 C53 C54 = Cap: Capacitor; Published: 8-Jun-2000; LatestRevisionDate: 17-Jul-2002; LatestRevisionNote: Re-released for DXP Platform.; PackageReference: RAD-0.3; Publisher: Altium Limited
R35-R40 = Res1: Resistor; Published: 8-Jun-2000; LatestRevisionDate: 17-Jul-2002; LatestRevisionNote: Re-released for DXP Platform.; PackageReference: AXIAL-0.3; Publisher: Altium Limited
U2 = LPC4330: MCU, 32BIT, ARM CORTEX M4&M0, 144LQFP; farnell: 2094316
U4 = AS7C34098: SRAM, 4MB, 3V, 12NS, 256K x 16, TSOP44; farnell: 1562920
U5 = AT25F512B: MEMORY, DATAFLASH, 512K, SPI, 8SOIC; farnell: 1715445

## Nets that join several sheets
+3.3: Debug (C51.1 R34.2 U10.5), m4_debug (26 pins), SRAM (10 pins)
+3.3_ISOL_D: audio (R14.2 R15.2 R16.2), power (C36.1 C78.1 L2.1 VR1.2)
AGND: audio (C55.1 C56.1 J1.1 NT1.2), audio/Preamp (10 pins), audio/Preamp (10 pins), audio/Preamp (10 pins), power (C52.2 C73.1)
DGND: audio (NT1.1), audio/Preamp (U9_audio_Preamp#1.7), audio/Preamp (U9_audio_Preamp#2.7), audio/Preamp (U9_audio_Preamp#3.7), power (6 pins)
GND: apb (P1.1 P3.1 P4.1), Debug (C51.2 S1.2 U10.3), power (C76.2 U11.2 U11.3), m4_debug (18 pins), SRAM (10 pins)
VA+: audio/Preamp (C70_audio_Preamp#1.1 R29_audio_Preamp#1.2 U9_audio_Preamp#1.16), audio/Preamp (C70_audio_Preamp#2.1 R29_audio_Preamp#2.2 U9_audio_Preamp#2.16), audio/Preamp (C70_audio_Preamp#3.1 R29_audio_Preamp#3.2 U9_audio_Preamp#3.16), power (C32.1 C73.2 L4.1 U11.14)
VA-: audio/Preamp (C75_audio_Preamp#1.1 U9_audio_Preamp#1.13 U9_audio_Preamp#1.17), audio/Preamp (C75_audio_Preamp#2.1 U9_audio_Preamp#2.13 U9_audio_Preamp#2.17), audio/Preamp (C75_audio_Preamp#3.1 U9_audio_Preamp#3.13 U9_audio_Preamp#3.17), power (C31.2 C52.1 L3.2)
VD-: audio/Preamp (C74_audio_Preamp#1.1 U9_audio_Preamp#1.12), audio/Preamp (C74_audio_Preamp#2.1 U9_audio_Preamp#2.12), audio/Preamp (C74_audio_Preamp#3.1 U9_audio_Preamp#3.12), power (C31.1 C67.1 L3.1 U11.11)
NetC63_audio_Preamp#1_2: audio/Preamp (C63_audio_Preamp#1.2 U9_audio_Preamp#1.22), audio/Preamp (C63_audio_Preamp#2.2 U9_audio_Preamp#2.22), audio/Preamp (C63_audio_Preamp#3.2 U9_audio_Preamp#3.22)
NetU9_audio_Preamp#1_8: audio/Preamp (U9_audio_Preamp#1.8), audio/Preamp (U9_audio_Preamp#2.11)
NetU9_audio_Preamp#2_8: audio/Preamp (U9_audio_Preamp#2.8), audio/Preamp (U9_audio_Preamp#3.11)
OUT_ISOL3: audio (R14.1), audio/Preamp (U9_audio_Preamp#1.9), audio/Preamp (U9_audio_Preamp#2.9), audio/Preamp (U9_audio_Preamp#3.9)
OUT_ISOL5: audio/Preamp (U9_audio_Preamp#1.10), audio/Preamp (U9_audio_Preamp#2.10), audio/Preamp (U9_audio_Preamp#3.10)